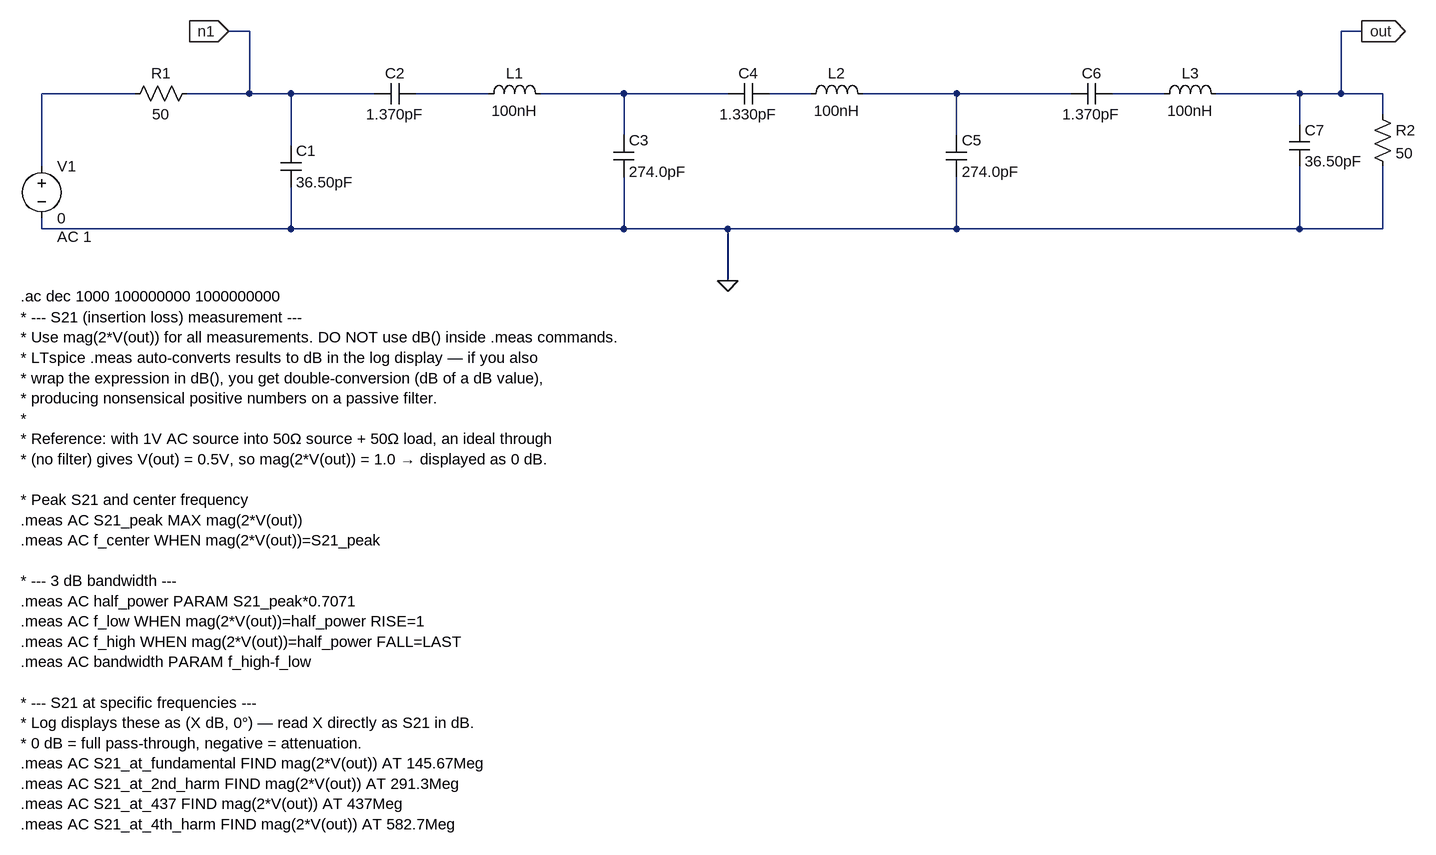
[diagram p0: schematic 437MHz_BPF_v02.asc]
437MHz_BPF_v02.asc, the LTspice schematic file:
Version 4.1
SHEET 1 2152 1140
WIRE 160 -16 128 -16
WIRE 1872 -16 1840 -16
WIRE -16 80 -160 80
WIRE 160 80 160 -16
WIRE 160 80 64 80
WIRE 224 80 160 80
WIRE 352 80 224 80
WIRE 528 80 416 80
WIRE 736 80 608 80
WIRE 896 80 736 80
WIRE 1024 80 960 80
WIRE 1248 80 1104 80
WIRE 1424 80 1248 80
WIRE 1568 80 1488 80
WIRE 1776 80 1648 80
WIRE 1840 80 1840 -16
WIRE 1840 80 1776 80
WIRE 1904 80 1840 80
WIRE 1904 112 1904 80
WIRE 1776 128 1776 80
WIRE 736 144 736 80
WIRE 1248 144 1248 80
WIRE 224 160 224 80
WIRE -160 192 -160 80
WIRE -160 288 -160 272
WIRE 224 288 224 224
WIRE 224 288 -160 288
WIRE 736 288 736 208
WIRE 736 288 224 288
WIRE 896 288 736 288
WIRE 1248 288 1248 208
WIRE 1248 288 896 288
WIRE 1776 288 1776 192
WIRE 1776 288 1248 288
WIRE 1904 288 1904 192
WIRE 1904 288 1776 288
WIRE 896 368 896 288
FLAG 896 368 0
FLAG 128 -16 n1
IOPIN 128 -16 In
FLAG 1872 -16 out
IOPIN 1872 -16 Out
SYMBOL voltage -160 176 R0
WINDOW 123 24 124 Left 2
WINDOW 39 0 0 Left 0
SYMATTR Value2 AC 1
SYMATTR InstName V1
SYMATTR Value 0
SYMBOL res 80 64 R90
WINDOW 0 0 56 VBottom 2
WINDOW 3 32 56 VTop 2
SYMATTR InstName R1
SYMATTR Value 50
SYMBOL cap 208 160 R0
SYMATTR InstName C1
SYMATTR Value 36.50pF
SYMBOL cap 416 64 R90
WINDOW 0 0 32 VBottom 2
WINDOW 3 32 32 VTop 2
SYMATTR InstName C2
SYMATTR Value 1.370pF
SYMBOL ind 512 96 R270
WINDOW 0 32 56 VTop 2
WINDOW 3 5 56 VBottom 2
SYMATTR InstName L1
SYMATTR Value 100nH
SYMBOL cap 720 144 R0
SYMATTR InstName C3
SYMATTR Value 274.0pF
SYMBOL cap 960 64 R90
WINDOW 0 0 32 VBottom 2
WINDOW 3 32 32 VTop 2
SYMATTR InstName C4
SYMATTR Value 1.330pF
SYMBOL ind 1008 96 R270
WINDOW 0 32 56 VTop 2
WINDOW 3 5 56 VBottom 2
SYMATTR InstName L2
SYMATTR Value 100nH
SYMBOL cap 1232 144 R0
SYMATTR InstName C5
SYMATTR Value 274.0pF
SYMBOL cap 1488 64 R90
WINDOW 0 0 32 VBottom 2
WINDOW 3 32 32 VTop 2
SYMATTR InstName C6
SYMATTR Value 1.370pF
SYMBOL ind 1552 96 R270
WINDOW 0 32 56 VTop 2
WINDOW 3 5 56 VBottom 2
SYMATTR InstName L3
SYMATTR Value 100nH
SYMBOL cap 1760 128 R0
SYMATTR InstName C7
SYMATTR Value 36.50pF
SYMBOL res 1888 96 R0
SYMATTR InstName R2
SYMATTR Value 50
TEXT -192 392 Left 2 !.ac dec 1000 100000000 1000000000
TEXT -192 424 Left 2 !* --- S21 (insertion loss) measurement ---\n* Use mag(2*V(out)) for all measurements. DO NOT use dB() inside .meas commands.\n* LTspice .meas auto-converts results to dB in the log display — if you also\n* wrap the expression in dB(), you get double-conversion (dB of a dB value),\n* producing nonsensical positive numbers on a passive filter.\n*\n* Reference: with 1V AC source into 50Ω source + 50Ω load, an ideal through\n* (no filter) gives V(out) = 0.5V, so mag(2*V(out)) = 1.0 → displayed as 0 dB.\n \n* Peak S21 and center frequency\n.meas AC S21_peak MAX mag(2*V(out))\n.meas AC f_center WHEN mag(2*V(out))=S21_peak\n \n* --- 3 dB bandwidth ---\n.meas AC half_power PARAM S21_peak*0.7071\n.meas AC f_low WHEN mag(2*V(out))=half_power RISE=1\n.meas AC f_high WHEN mag(2*V(out))=half_power FALL=LAST\n.meas AC bandwidth PARAM f_high-f_low\n \n* --- S21 at specific frequencies ---\n* Log displays these as (X dB, 0°) — read X directly as S21 in dB.\n* 0 dB = full pass-through, negative = attenuation.\n.meas AC S21_at_fundamental FIND mag(2*V(out)) AT 145.67Meg\n.meas AC S21_at_2nd_harm FIND mag(2*V(out)) AT 291.3Meg\n.meas AC S21_at_437 FIND mag(2*V(out)) AT 437Meg\n.meas AC S21_at_4th_harm FIND mag(2*V(out)) AT 582.7Meg

The netlist it stands for:
* 437MHz_BPF_v02.asc
V1 N001 0 0 AC 1
R1 n1 N001 50
C1 n1 0 36.50pF
C2 N002 n1 1.370pF
L1 N002 N003 100nH
C3 N003 0 274.0pF
C4 N004 N003 1.330pF
L2 N004 N005 100nH
C5 N005 0 274.0pF
C6 N006 N005 1.370pF
L3 N006 out 100nH
C7 out 0 36.50pF
R2 out 0 50
.ac dec 1000 100000000 1000000000
* --- S21 (insertion loss) measurement ---
* Use mag(2*V(out)) for all measurements. DO NOT use dB() inside .meas commands.
* LTspice .meas auto-converts results to dB in the log display — if you also
* wrap the expression in dB(), you get double-conversion (dB of a dB value),
* producing nonsensical positive numbers on a passive filter.
*
* Reference: with 1V AC source into 50Ω source + 50Ω load, an ideal through
* (no filter) gives V(out) = 0.5V, so mag(2*V(out)) = 1.0 → displayed as 0 dB.
* Peak S21 and center frequency
.meas AC S21_peak MAX mag(2*V(out))
.meas AC f_center WHEN mag(2*V(out))=S21_peak
* --- 3 dB bandwidth ---
.meas AC half_power PARAM S21_peak*0.7071
.meas AC f_low WHEN mag(2*V(out))=half_power RISE=1
.meas AC f_high WHEN mag(2*V(out))=half_power FALL=LAST
.meas AC bandwidth PARAM f_high-f_low
* --- S21 at specific frequencies ---
* Log displays these as (X dB, 0°) — read X directly as S21 in dB.
* 0 dB = full pass-through, negative = attenuation.
.meas AC S21_at_fundamental FIND mag(2*V(out)) AT 145.67Meg
.meas AC S21_at_2nd_harm FIND mag(2*V(out)) AT 291.3Meg
.meas AC S21_at_437 FIND mag(2*V(out)) AT 437Meg
.meas AC S21_at_4th_harm FIND mag(2*V(out)) AT 582.7Meg
.backanno
.end